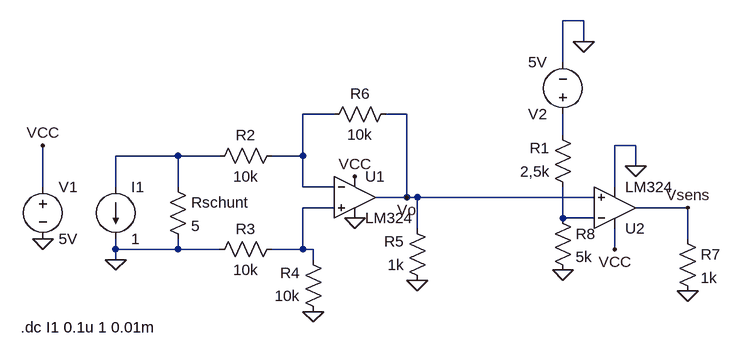
[diagram p0: schematic sim_sensor_corrent.asc]
sim_sensor_corrent.asc, the LTspice schematic file:
Version 4
SHEET 1 880 680
WIRE 624 -112 592 -112
WIRE 624 -80 624 -112
WIRE 592 -48 592 -112
WIRE 240 32 192 32
WIRE 352 32 320 32
WIRE 592 64 592 32
WIRE 704 80 672 80
WIRE 0 96 -96 96
WIRE 64 96 0 96
WIRE 192 96 192 32
WIRE 192 96 144 96
WIRE 704 112 704 80
WIRE -208 144 -208 80
WIRE -96 144 -96 96
WIRE 0 144 0 96
WIRE 192 144 192 96
WIRE 240 144 192 144
WIRE 672 144 672 80
WIRE 352 160 352 32
WIRE 352 160 304 160
WIRE 368 160 352 160
WIRE 640 160 368 160
WIRE 240 176 192 176
WIRE 784 176 704 176
WIRE 592 192 592 144
WIRE 640 192 592 192
WIRE 368 208 368 160
WIRE 784 224 784 176
WIRE -96 240 -96 224
WIRE 0 240 0 224
WIRE 0 240 -96 240
WIRE 64 240 0 240
WIRE 192 240 192 176
WIRE 192 240 144 240
WIRE 208 240 192 240
WIRE 672 240 672 208
WIRE -96 256 -96 240
WIRE 208 256 208 240
FLAG -96 256 0
FLAG 208 336 0
FLAG 368 288 0
FLAG 592 272 0
FLAG 784 304 0
FLAG -208 224 0
FLAG -208 80 VCC
FLAG 272 192 0
FLAG 272 128 VCC
FLAG 672 240 VCC
FLAG 704 112 0
FLAG 624 -80 0
FLAG 784 176 Vsens
FLAG 352 160 Vo
SYMBOL voltage -208 128 R0
SYMATTR InstName V1
SYMATTR Value 5V
SYMBOL current -96 144 R0
WINDOW 123 0 0 Left 0
WINDOW 39 0 0 Left 0
SYMATTR InstName I1
SYMATTR Value 1
SYMBOL res -16 128 R0
SYMATTR InstName Rschunt
SYMATTR Value 5
SYMBOL res 160 80 R90
WINDOW 0 0 56 VBottom 2
WINDOW 3 32 56 VTop 2
SYMATTR InstName R2
SYMATTR Value 10k
SYMBOL res 160 224 R90
WINDOW 0 0 56 VBottom 2
WINDOW 3 32 56 VTop 2
SYMATTR InstName R3
SYMATTR Value 10k
SYMBOL res 224 352 R180
WINDOW 0 36 76 Left 2
WINDOW 3 36 40 Left 2
SYMATTR InstName R4
SYMATTR Value 10k
SYMBOL res 384 304 R180
WINDOW 0 36 76 Left 2
WINDOW 3 36 40 Left 2
SYMATTR InstName R5
SYMATTR Value 1k
SYMBOL res 224 48 R270
WINDOW 0 32 56 VTop 2
WINDOW 3 0 56 VBottom 2
SYMATTR InstName R6
SYMATTR Value 10k
SYMBOL res 768 208 R0
SYMATTR InstName R7
SYMATTR Value 1k
SYMBOL res 576 176 R0
SYMATTR InstName R8
SYMATTR Value 5k
SYMBOL res 608 160 R180
WINDOW 0 36 76 Left 2
WINDOW 3 36 40 Left 2
SYMATTR InstName R1
SYMATTR Value 2,5k
SYMBOL voltage 592 48 R180
WINDOW 123 0 0 Left 0
WINDOW 39 0 0 Left 0
SYMATTR InstName V2
SYMATTR Value 5V
SYMBOL LM324 272 96 R0
SYMATTR InstName U1
SYMBOL LM324 672 240 M180
SYMATTR InstName U2
TEXT -242 360 Left 2 !.dc I1 0.1u 1 0.01m

The netlist it stands for:
* sim_sensor_corrent.asc
V1 VCC 0 5V
I1 N003 0 1
Rschunt N003 0 5
R2 N001 N003 10k
R3 N004 0 10k
R4 0 N004 10k
R5 0 Vo 1k
R6 N001 Vo 10k
R7 Vsens 0 1k
R8 N005 0 5k
R1 N005 N002 2,5k
V2 N002 0 5V
* U1: LM324 (symbol LM324 not available, pins judged from their places): In+=N004 In-=N001 V+=VCC V-=0 OUT=Vo
* U2: LM324 (symbol LM324 not available, pins judged from their places): In+=Vo In-=N005 V+=VCC V-=0 OUT=Vsens
.dc I1 0.1u 1 0.01m
.backanno
.end